# EAGLE design 00B-001 (EAGLE 9.6.2)
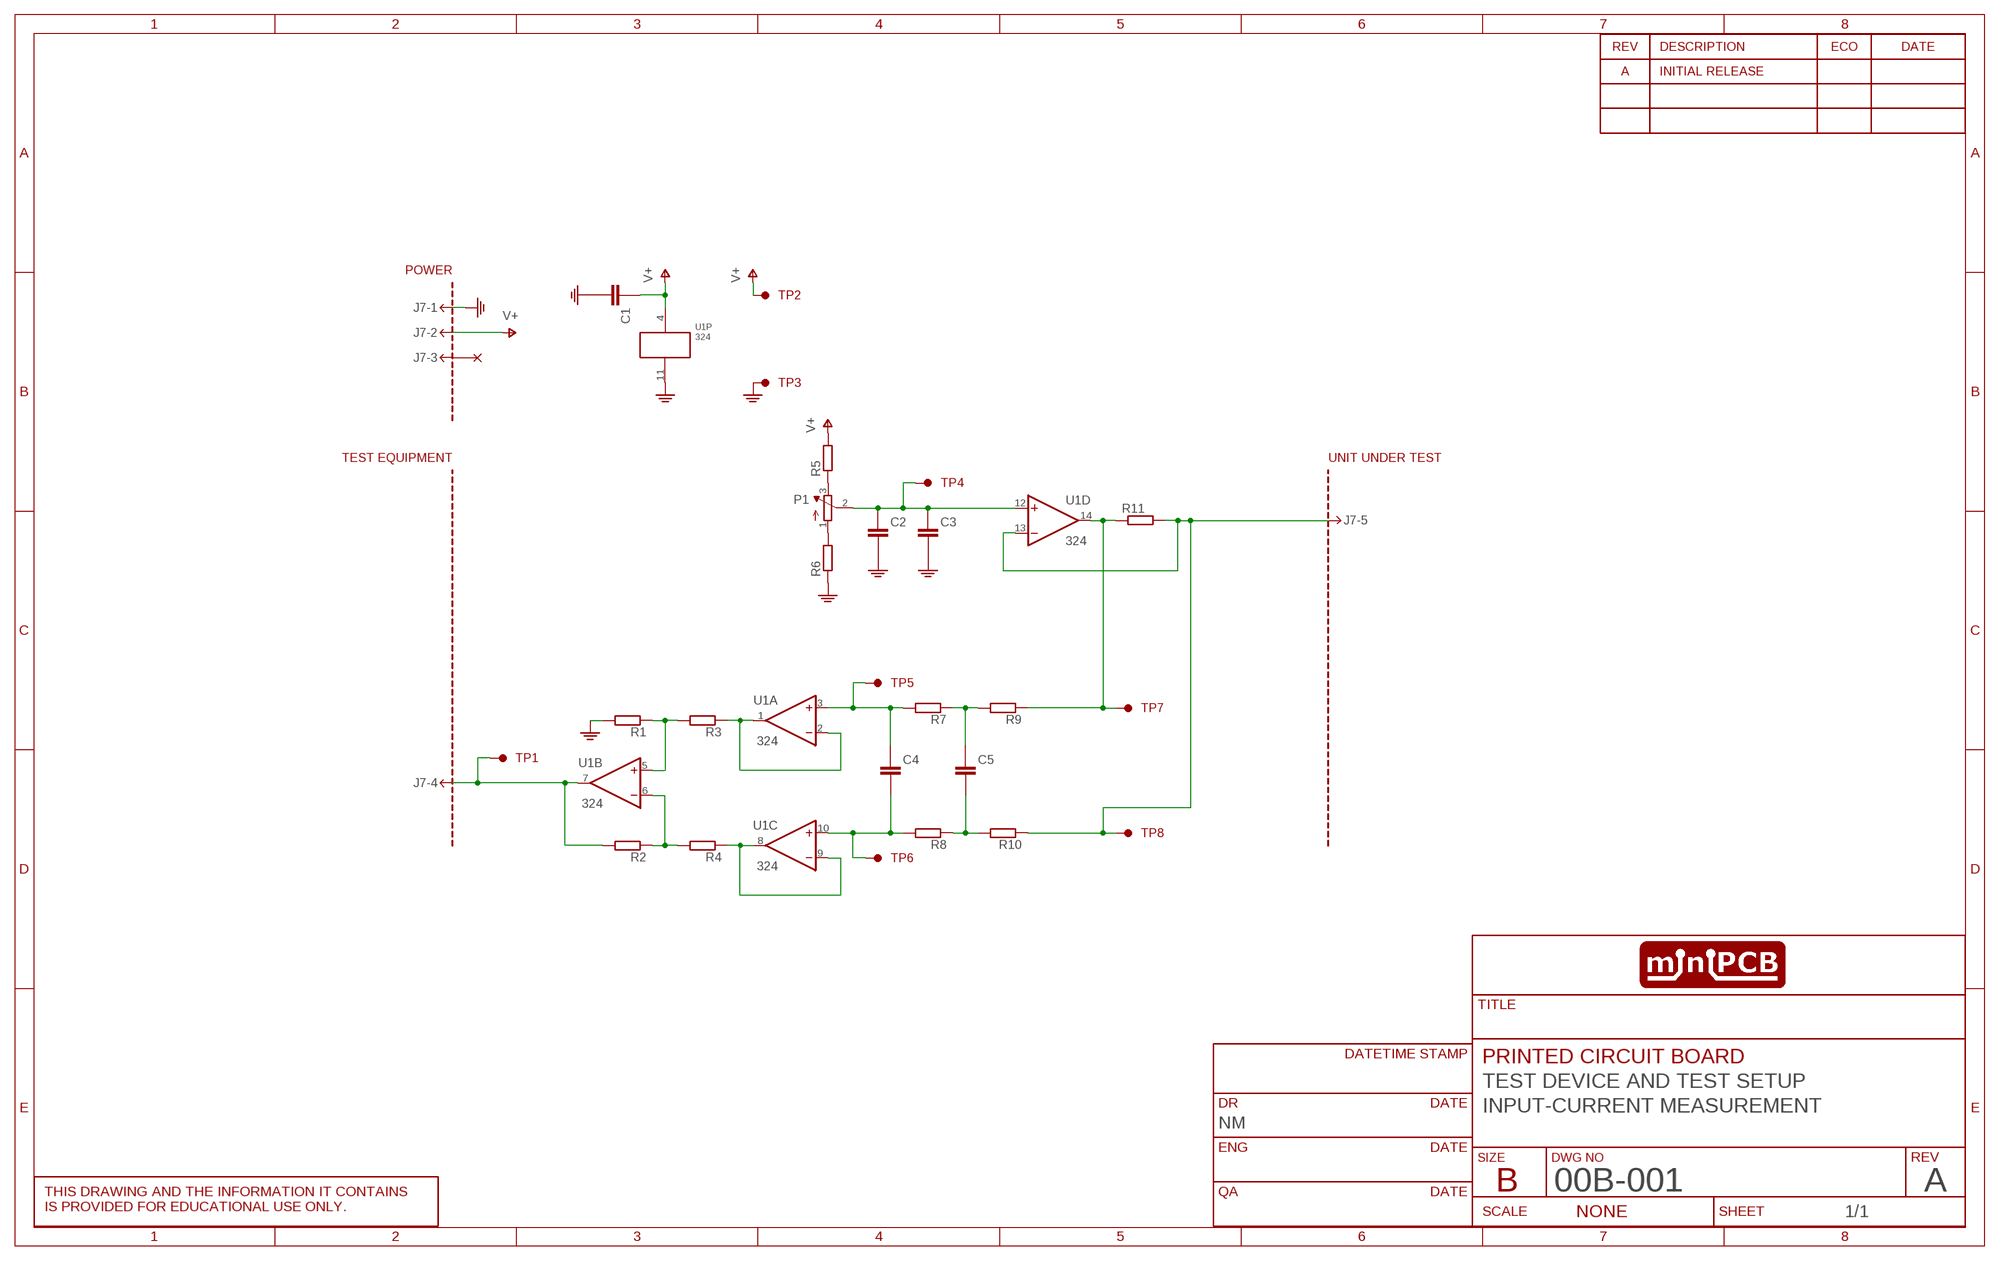
[diagram p0: schematic, sheet 1]
SHEET1 (SCHEMATIC): CIRCUIT_CATEGORY: TEST DEVICE AND TEST SETUP; CIRCUIT_NAME: INPUT-CURRENT MEASUREMENT; DR: NM; PCB_PCBA: PRINTED CIRCUIT BOARD; REVA: A; REVISION: A

## Parts
C1  1u  CAPACITORTHD  [C050-024X044]
C2  CAPACITOR_10  [C5MM]
C3  CAPACITORTHD  [C050-024X044]
C4  CAPACITORTHD  [C050-024X044]
C5  CAPACITORTHD  [C050-024X044]
J7-  MINIPCB_5P50X50  [MINIPCB_5P_50X50MM]
P1  TRIMPOT0.100THD  [TRIM_0100]
R1  RESISTOR10MM  [0207/10]
R2  RESISTOR10MM  [0207/10]
R3  RESISTOR10MM  [0207/10]
R4  RESISTOR10MM  [0207/10]
R5  RESISTOR10MM  [0207/10]
R6  RESISTOR10MM  [0207/10]
R7  RESISTOR10MM  [0207/10]
R8  RESISTOR10MM  [0207/10]
R9  RESISTOR10MM  [0207/10]
R10  RESISTOR10MM  [0207/10]
R11  RESISTOR10MM  [0207/10]
TP1  TESTPOINTKE5000-SMTEXT  [PINS_1_TESTPOINT_KE5000_NOTEXT]
TP2  TESTPOINTKE5000-SMTEXT  [PINS_1_TESTPOINT_KE5000_NOTEXT]
TP3  TESTPOINTKE5000-SMTEXT  [PINS_1_TESTPOINT_KE5000_NOTEXT]
TP4  TESTPOINTKE5000-SMTEXT  [PINS_1_TESTPOINT_KE5000_NOTEXT]
TP5  TESTPOINTKE5000-SMTEXT  [PINS_1_TESTPOINT_KE5000_NOTEXT]
TP6  TESTPOINTKE5000-SMTEXT  [PINS_1_TESTPOINT_KE5000_NOTEXT]
TP7  TESTPOINTKE5000-SMTEXT  [PINS_1_TESTPOINT_KE5000_NOTEXT]
TP8  TESTPOINTKE5000-SMTEXT  [PINS_1_TESTPOINT_KE5000_NOTEXT]
U1  324  OPAMP_QUADTHD  [DIL14]

## Nets
GND: C1.2(-) C2.- C3.2(-) J7-.1 R1.2 R6.1 TP3.1 U1.11(P:V-)
N$1: R9.1 R11.1 TP7.1 U1.14(D:OUT)
N$2: R3.1 U1.1(A:OUT) U1.2(A:-IN)
N$3: R4.1 U1.8(C:OUT) U1.9(C:-IN)
N$4: C2.+ C3.1(+) P1.2(S) TP4.1 U1.12(D:+IN)
N$5: P1.1(A) R6.2
N$6: P1.3(E) R5.1
N$7: J7-.5 R10.1 R11.2 TP8.1 U1.13(D:-IN)
N$8: R2.1 R4.2 U1.6(B:-IN)
N$9: R1.1 R3.2 U1.5(B:+IN)
N$10: J7-.4 R2.2 TP1.1 U1.7(B:OUT)
N$14: C4.1(+) R7.2 TP5.1 U1.3(A:+IN)
N$15: C4.2(-) R8.2 TP6.1 U1.10(C:+IN)
N$16: C5.1(+) R7.1 R9.2
N$17: C5.2(-) R8.1 R10.2
V+: C1.1(+) J7-.2 R5.2 TP2.1 U1.4(P:V+)
Unconnected: J7-.3

## Library data of the parts
C1-C5 = minipcb:CAPACITOR
J7- = minipcb:MINIPCB_5P; PART_NUMBER: 00B-001; REVISION: A
P1 = minipcb:TRIMPOT: SMT trimmer potentiometer part number TC33X http://www.ladyada.net/library/eagle
R1-R11 = minipcb:RESISTOR
TP1-TP8 = minipcb:TESTPOINT
U1 = minipcb:OPAMP_QUAD: OP AMP

## Board
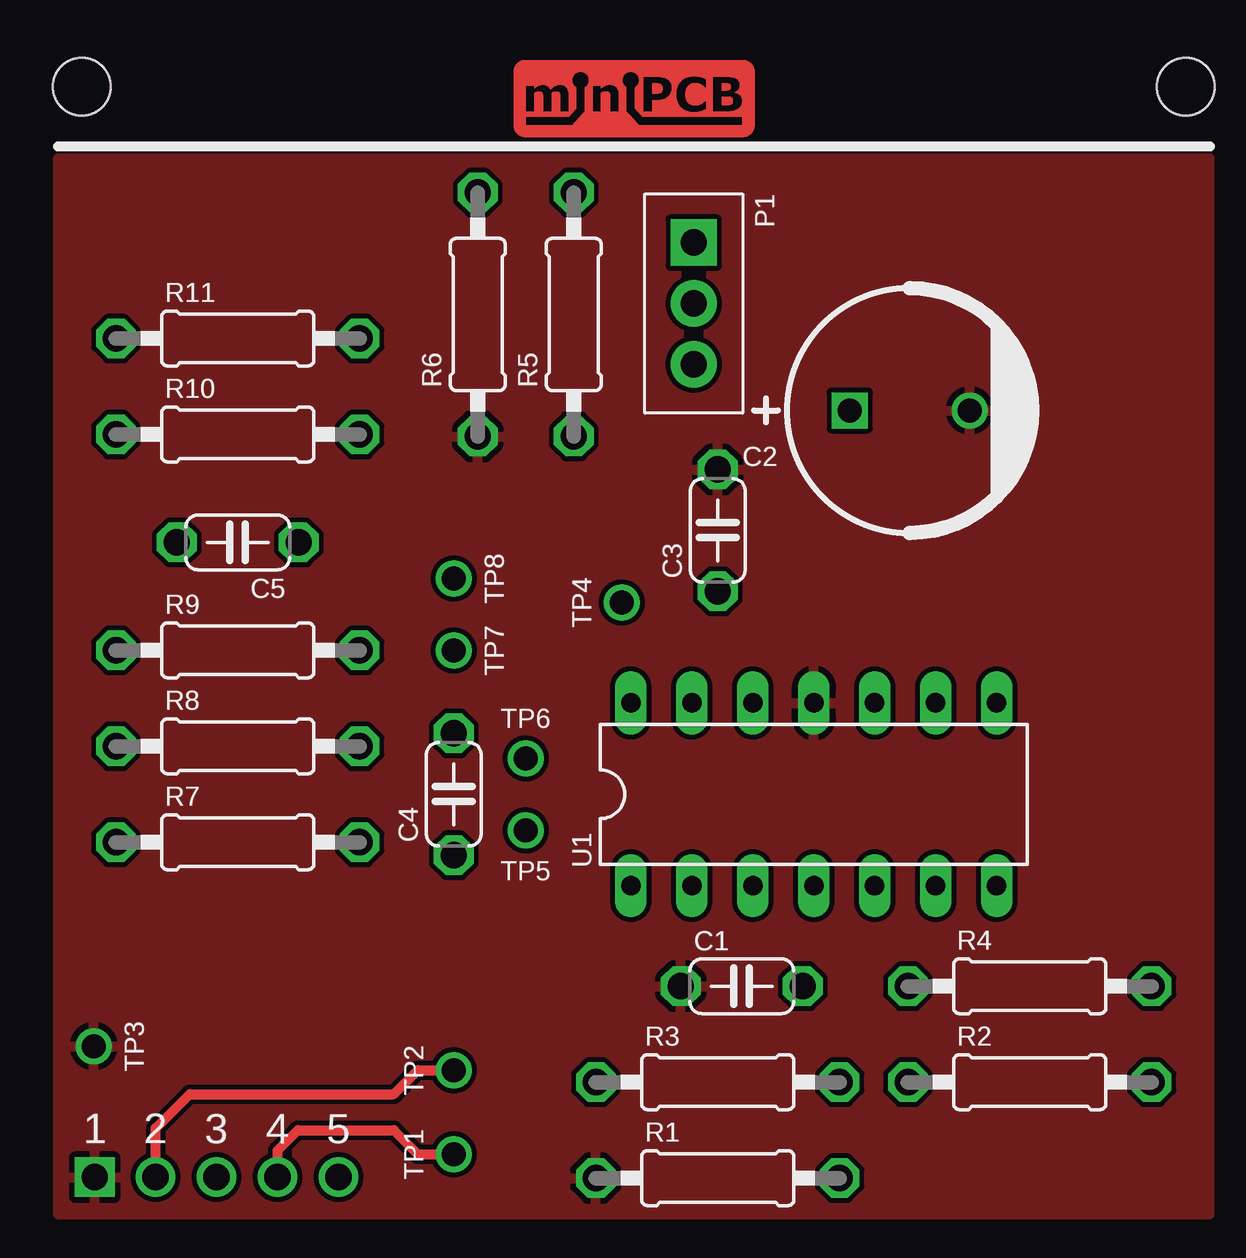
[diagram p1: board, top side]
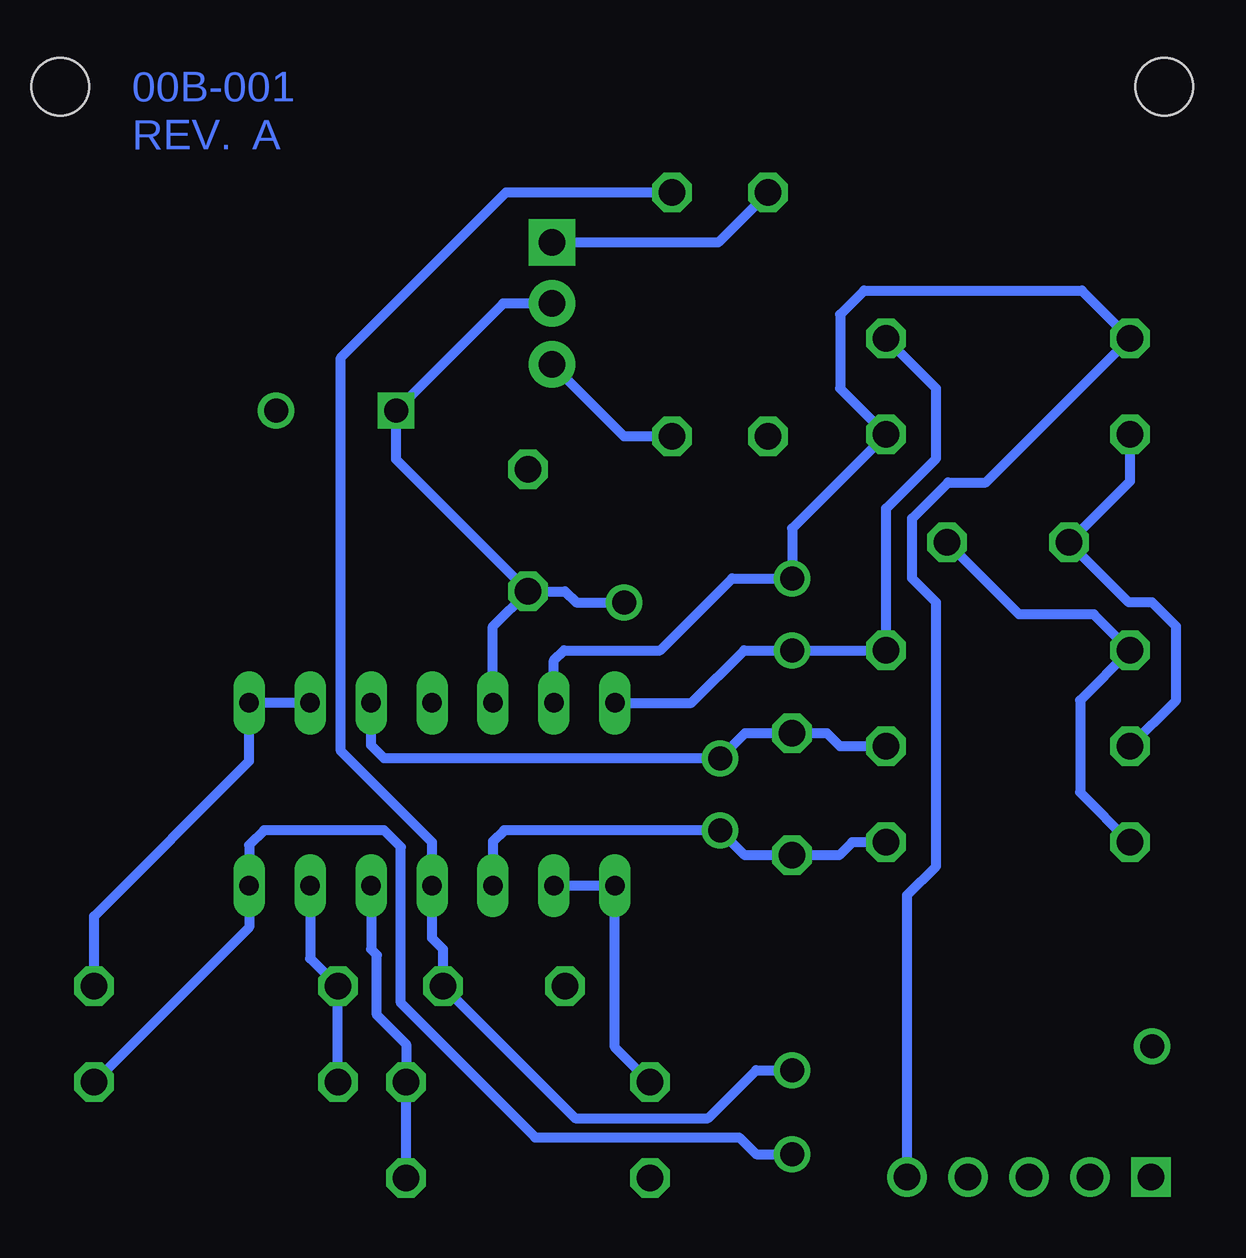
[diagram p2: board, bottom side, seen from below]

No outline drawn. Coordinates in mm, seen from the top.
Copper layers (1*16): Top 0.035mm / dielectric 1.5mm / Bottom 0.035mm
Design rules "minipcb": minimum track width 10mil, minimum drill 24mil, track to track 8mil, track to pad 8mil, pad to pad 8mil, via to via 8mil, smd to smd 8mil, copper to edge 40mil, drill to drill 8mil, minimum pad ring 10mil, minimum via ring 8mil, stop-mask expansion 4mil, vias tented up to drill 20mil, thermal gap 10mil

### Footprints (pad centres in the part's own frame; a part is rotated, then mirrored left to right if it is on the bottom)
C050-024X044 = drill 1.1 octagon: 1 -2.54,0; 2 2.54,0
C5MM = drill 1 square: + -2.5,0 | drill 1: - 2.5,0
MINIPCB_5P_50X50MM = drill 1.1 square: 1 2.54,2.54 | drill 1.1: 2 5.08,2.54; 3 7.62,2.54; 4 10.16,2.54; 5 12.7,2.54 | hole 2.4: 48,48; 2,48
TRIM_0100 = drill 1.1 pad 1.93 square: 1 0,0 | drill 1.1 pad 1.93: 2 2.54,0; 3 5.08,0
0207/10 = drill 1.1 octagon: 1 -5.08,0; 2 5.08,0
PINS_1_TESTPOINT_KE5000_NOTEXT = drill 1: 1 0,0
DIL14 = drill 0.813 long: 1 -7.62,-3.81; 2 -5.08,-3.81; 3 -2.54,-3.81; 4 0,-3.81; 5 2.54,-3.81; 6 5.08,-3.81; 7 7.62,-3.81; 8 7.62,3.81; 9 5.08,3.81; 10 2.54,3.81; 11 0,3.81; 12 -2.54,3.81; 13 -5.08,3.81; 14 -7.62,3.81

### Placement (x,y rotation side)
C1  29.5,10.5 180 top
C2  36.5,34.5 0 top
C3  28.5,29.5 90 top
C4  17.5,18.5 90 top
C5  8.5,29 180 top
J7-  0,0 0 top
P1  27.5,41.5 270 top
R1  28.5,2.5 180 top
R2  41.5,6.5 0 top
R3  28.5,6.5 0 top
R4  41.5,10.5 180 top
R5  22.5,38.5 90 top
R6  18.5,38.5 90 top
R7  8.5,16.5 0 top
R8  8.5,20.5 0 top
R9  8.5,24.5 180 top
R10  8.5,33.5 180 top
R11  8.5,37.5 180 top
TP1  17.5,3.5 90 top
TP2  17.5,7 90 top
TP3  2.5,8 270 top
TP4  24.5,26.5 90 top
TP5  20.5,17 180 top
TP6  20.5,20 0 top
TP7  17.5,24.5 270 top
TP8  17.5,27.5 270 top
U1  32.5,18.5 0 top

### Tracks (layer width: path | path; a pad name or v marks a point on that pad's centre or on a via)
GND
  pour Top: 1,1 49,1 49,45 1,45
N$1
  Bottom 0.406: U1.14 21.69,22.31 19.5,24.5 TP7.1 R9.1 13.58,30.42 11.5,32.5 11.5,35.42 R11.1
N$2
  Bottom 0.406: R3.1 24.88,7.96 U1.1 U1.2
N$3
  Bottom 0.406: U1.9 U1.8 40.12,19.88 46.58,13.42 R4.1
N$4
  Bottom 0.406: U1.12 29.96,25.5 C3.1 | C3.1 26.96,26.96 26.5,26.5 TP4.1 | C3.1 34,32.46 C2.+ 29.54,38.96 P1.2
N$5
  Bottom 0.406: R6.2 20.58,41.5 P1.1
N$6
  Bottom 0.406: R5.1 24.5,33.42 P1.3
N$7
  Bottom 0.406: U1.13 27.42,24.08 27,24.5 23,24.5 20,27.5 TP8.1 17.5,29.58 R10.1 15.5,35.42 15.5,38.5 14.5,39.5 5.42,39.5 R11.2 9.42,31.5 11,31.5 12.5,30 12.5,27.5 11.5,26.5 11.5,15.5 12.7,14.3 J7-.5
N$8
  Bottom 0.406: R2.1 R4.2 37.58,11.66 U1.6
N$9
  Bottom 0.406: R1.1 R3.2 33.58,8.08 34.8,9.3 34.8,11.8 35.04,12.04 U1.5
N$10
  Top 0.406: J7-.4 10.16,3.66 11,4.5 15,4.5 16,3.5 TP1.1
  Bottom 0.406: TP1.1 19,3.5 19.7,4.2 28.2,4.2 33.8,9.8 33.8,16.3 34.5,17 39.5,17 40.12,16.38 U1.7 40.12,12.96 R2.2
N$14
  Bottom 0.406: R7.2 15,16.5 15.54,15.96 C4.1 19.46,15.96 TP5.1 29.5,17 29.96,16.54 U1.3
N$15
  Bottom 0.406: R8.2 15.5,20.5 16.04,21.04 C4.2 19.46,21.04 TP6.1 34.5,20 35.04,20.54 U1.10
N$16
  Bottom 0.406: R7.1 5.5,18.58 5.5,22.42 R9.2 4.92,26 8.04,26 C5.1
N$17
  Bottom 0.406: R10.2 3.42,31.54 C5.2 3.46,26.5 2.5,26.5 1.5,25.5 1.5,22.42 R8.1
V+
  Top 0.406: J7-.2 5.08,4.58 6.5,6 15,6 16,7 TP2.1
  Bottom 0.406: R5.2 29.42,43.58 36.3,36.7 36.3,20.3 32.5,16.5 U1.4 32.5,12.5 32.04,12.04 C1.1 26.54,5 21,5 19,7 TP2.1

### Text on the board
_tNames: P1 | R11 | R10 | R6 | R5 | C2 | C5 | TP8 | C3 | R9 | TP4 | TP7 | R8 | TP6 | R7 | C4 | TP5 | U1 | C1 | R4 | TP3 | R3 | R2 | TP2 | R1 | TP1